# Altium schematic sheet Conector.SchDoc
size A3; SheetNumber: 6; SheetTotal: 23
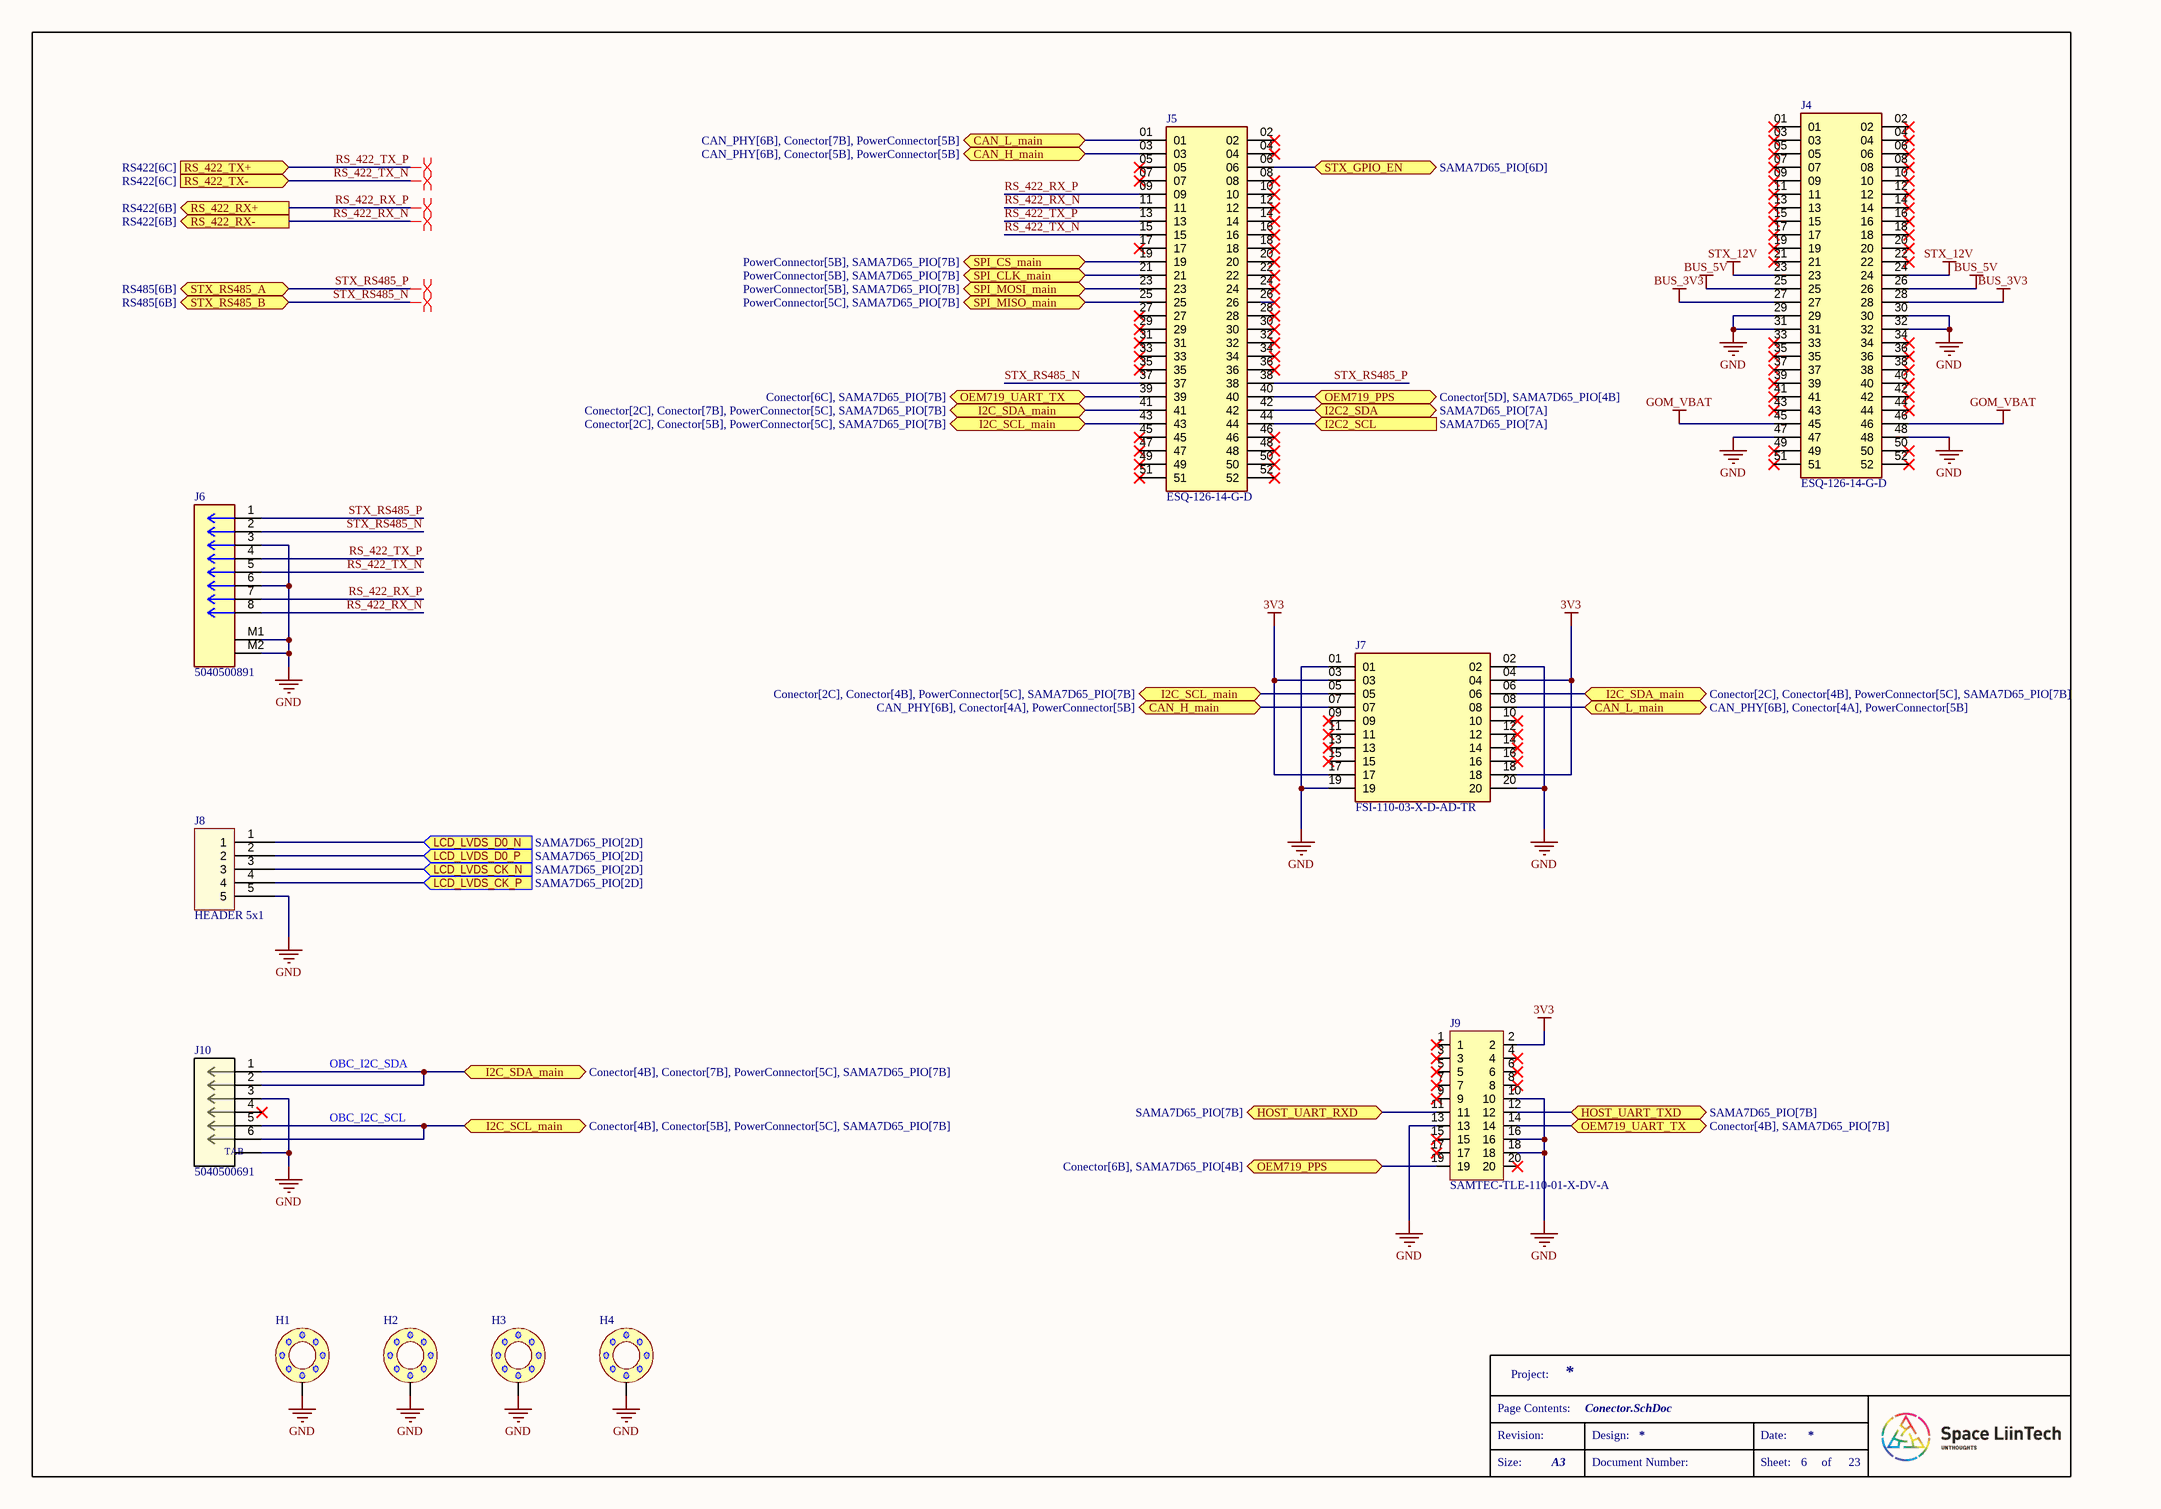
[diagram p0: Conector.SchDoc]

## Parts
H1  hole_space  [HOLE_SPACE]  (value not drawn)
H2  hole_space  [HOLE_SPACE]  (value not drawn)
H3  hole_space  [HOLE_SPACE]  (value not drawn)
H4  hole_space  [HOLE_SPACE]  (value not drawn)
J4  ESQ-126-14-G-D  [ESQ-126-14-G-D]
J5  ESQ-126-14-G-D  [ESQ-126-14-G-D]
J6  5040500891  [MOLEX_5040500891]
J7  FSI-110-03-X-D-AD-TR  [SAMTEC_FSI-110-03-X-D-AD-TR]
J8  HEADER 5x1  [Header_254P_5x1]
J9  SAMTEC-TLE-110-01-X-DV-A  [SAMTEC-TLE-110-01-X-DV-A]
J10  5040500691  [5040500691]

## Ports
CAN_H_main (bidir, see CAN_PHY[6B], Conector[4A], PowerConnector[5B]), CAN_H_main (bidir, see CAN_PHY[6B], Conector[5B], PowerConnector[5B]), CAN_L_main (bidir, see CAN_PHY[6B], Conector[4A], PowerConnector[5B]), CAN_L_main (bidir, see CAN_PHY[6B], Conector[7B], PowerConnector[5B]), HOST_UART_RXD (bidir, see SAMA7D65_PIO[7B]), HOST_UART_TXD (bidir, see SAMA7D65_PIO[7B]), I2C2_SCL (in, see SAMA7D65_PIO[7A]), I2C2_SDA (bidir, see SAMA7D65_PIO[7A]), I2C_SCL_main (bidir, see Conector[2C], Conector[4B], PowerConnector[5C], SAMA7D65_PIO[7B]), I2C_SCL_main (bidir, see Conector[2C], Conector[5B], PowerConnector[5C], SAMA7D65_PIO[7B]), I2C_SCL_main (bidir, see Conector[4B], Conector[5B], PowerConnector[5C], SAMA7D65_PIO[7B]), I2C_SDA_main (bidir, see Conector[2C], Conector[4B], PowerConnector[5C], SAMA7D65_PIO[7B]), I2C_SDA_main (bidir, see Conector[2C], Conector[7B], PowerConnector[5C], SAMA7D65_PIO[7B]), I2C_SDA_main (bidir, see Conector[4B], Conector[7B], PowerConnector[5C], SAMA7D65_PIO[7B]), LCD_LVDS_CK_N (in, see SAMA7D65_PIO[2D]), LCD_LVDS_CK_P (in, see SAMA7D65_PIO[2D]), LCD_LVDS_D0_N (in, see SAMA7D65_PIO[2D]), LCD_LVDS_D0_P (in, see SAMA7D65_PIO[2D]), OEM719_PPS (bidir, see Conector[5D], SAMA7D65_PIO[4B]), OEM719_PPS (bidir, see Conector[6B], SAMA7D65_PIO[4B]), OEM719_UART_TX (bidir, see Conector[4B], SAMA7D65_PIO[7B]), OEM719_UART_TX (bidir, see Conector[6C], SAMA7D65_PIO[7B]), RS_422_RX+ (out, see RS422[6B]), RS_422_RX- (out, see RS422[6B]), RS_422_TX+ (in, see RS422[6C]), RS_422_TX- (in, see RS422[6C]), SPI_CLK_main (bidir, see PowerConnector[5B], SAMA7D65_PIO[7B]), SPI_CS_main (bidir, see PowerConnector[5B], SAMA7D65_PIO[7B]), SPI_MISO_main (bidir, see PowerConnector[5C], SAMA7D65_PIO[7B]), SPI_MOSI_main (bidir, see PowerConnector[5B], SAMA7D65_PIO[7B]), STX_GPIO_EN (bidir, see SAMA7D65_PIO[6D]), STX_RS485_A (bidir, see RS485[6B]), STX_RS485_B (bidir, see RS485[6B])

## Nets
3V3: J7.03 J7.04 J7.17 J7.18 J9.2
BUS_3V3: J4.27 J4.28
BUS_5V: J4.25 J4.26
GND: H1.1 H2.1 H3.1 H4.1 J4.29 J4.30 J4.31 J4.32 J4.47 J4.48 J6.3 J6.6 J6.M1 J6.M2 J7.01 J7.02 J7.19 J7.20 J8.5 J9.10 J9.13 J9.16 J9.18 J10.3 J10.7
GOM_VBAT: J4.45 J4.46
STX_12V: J4.23 J4.24
CAN_H_main: J5.03 J7.07 ; port CAN_H_main
CAN_L_main: J5.01 J7.08 ; port CAN_L_main
HOST_UART_RXD: J9.11 ; port HOST_UART_RXD
HOST_UART_TXD: J9.12 ; port HOST_UART_TXD
I2C2_SCL: J5.44 ; port I2C2_SCL
I2C2_SDA: J5.42 ; port I2C2_SDA
I2C_SCL_main: J5.43 J7.05 J10.5 J10.6 ; port I2C_SCL_main
I2C_SDA_main: J5.41 J7.06 J10.1 J10.2 ; port I2C_SDA_main
LCD_LVDS_CK_N: J8.3 ; port LCD_LVDS_CK_N
LCD_LVDS_CK_P: J8.4 ; port LCD_LVDS_CK_P
LCD_LVDS_D0_N: J8.1 ; port LCD_LVDS_D0_N
LCD_LVDS_D0_P: J8.2 ; port LCD_LVDS_D0_P
OEM719_PPS: J5.40 J9.19 ; port OEM719_PPS
OEM719_UART_TX: J5.39 J9.14 ; port OEM719_UART_TX
RS_422_RX_N: J5.11 J6.8 ; port RS_422_RX-
RS_422_RX_P: J5.09 J6.7 ; port RS_422_RX+
RS_422_TX_N: J5.15 J6.5 ; port RS_422_TX-
RS_422_TX_P: J5.13 J6.4 ; port RS_422_TX+
SPI_CLK_main: J5.21 ; port SPI_CLK_main
SPI_CS_main: J5.19 ; port SPI_CS_main
SPI_MISO_main: J5.25 ; port SPI_MISO_main
SPI_MOSI_main: J5.23 ; port SPI_MOSI_main
STX_GPIO_EN: J5.06 ; port STX_GPIO_EN
STX_RS485_N: J5.37 J6.2 ; port STX_RS485_B
STX_RS485_P: J5.38 J6.1 ; port STX_RS485_A

Not connected (* = marked no-connect by the designer): J4 01* 02* 03* 04* 05* 06* 07* 08* 09* 10* 11* 12* 13* 14* 15* 16* 17* 18* 19* 20* 21* 22* 33* 34* 35* 36* 37* 38* 39* 40* 41* 42* 43* 44* 49* 50* 51* 52*; J5 02* 04* 05* 07* 08* 10* 12* 14* 16* 17* 18* 20* 22* 24* 26* 27* 28* 29* 30* 31* 32* 33* 34* 35* 36* 45* 46* 47* 48* 49* 50* 51* 52*; J7 09* 10* 11* 12* 13* 14* 15* 16*; J9 1* 3* 4* 5* 6* 7* 8* 9* 15* 17* 20*; J10 4*

## Layout directives
differential pair: RS_422_RX_N, RS_422_RX_P, RS_422_TX_N, RS_422_TX_P, STX_RS485_N, STX_RS485_P

## Notes on the sheet
- OBC_I2C_SDA
- OBC_I2C_SCL
- Project:
- Page Contents:
- Revision:
- Design:
- Date:
- Size:
- A3
- Document Number:
- Sheet:
- of
- (in symbol 5040500691) TAB

## Library data of the parts
J4 J5 = ESQ-126-14-G-D: MF: Samtec; MP: ESQ-126-14-G-D; Price: None; Package: None; Value: *; Availability: Unavailable
J6 = 5040500891: Connector Header Surface Mount, Right Angle 8 position 0.059" (1.50mm)`
J7 = FSI-110-03-X-D-AD-TR: 1mm SINGLE ELEMENT INTERFACE; Price: None; Value: *; Package: None; MP: FSI-110-03-X-D-AD-TR; Availability: Unavailable
J10 = 5040500691: 1.50mm Pitch, Pico-Lock PCB Header, Single Row, Right-Angle, Surface Mount, Gold (Au) Plating, Positive Lock, 6 Circuits, Tape and Reel; Manufacturer_Name: Molex Connector Corporation; Copyright: Copyright (C) 2025 Ultra Librarian. All rights reserved.; Manufacturer_Part_Number: 5040500691; Datasheet: https://www.molex.com/en-us/products/part-detail-pdf/5040500691?display=pdf; RefDes: RefDes; Type: Type
J9 = SAMTEC-TLE-110-01-X-DV-A: Availability: Unavailable; MP: SAMTEC-TLE-110-01-X-DV-A; Price: None; Value: *; Package: None